# Altium schematic sheet BlockDiagram.SchDoc
size B; SheetNumber: 1; SheetTotal: 7
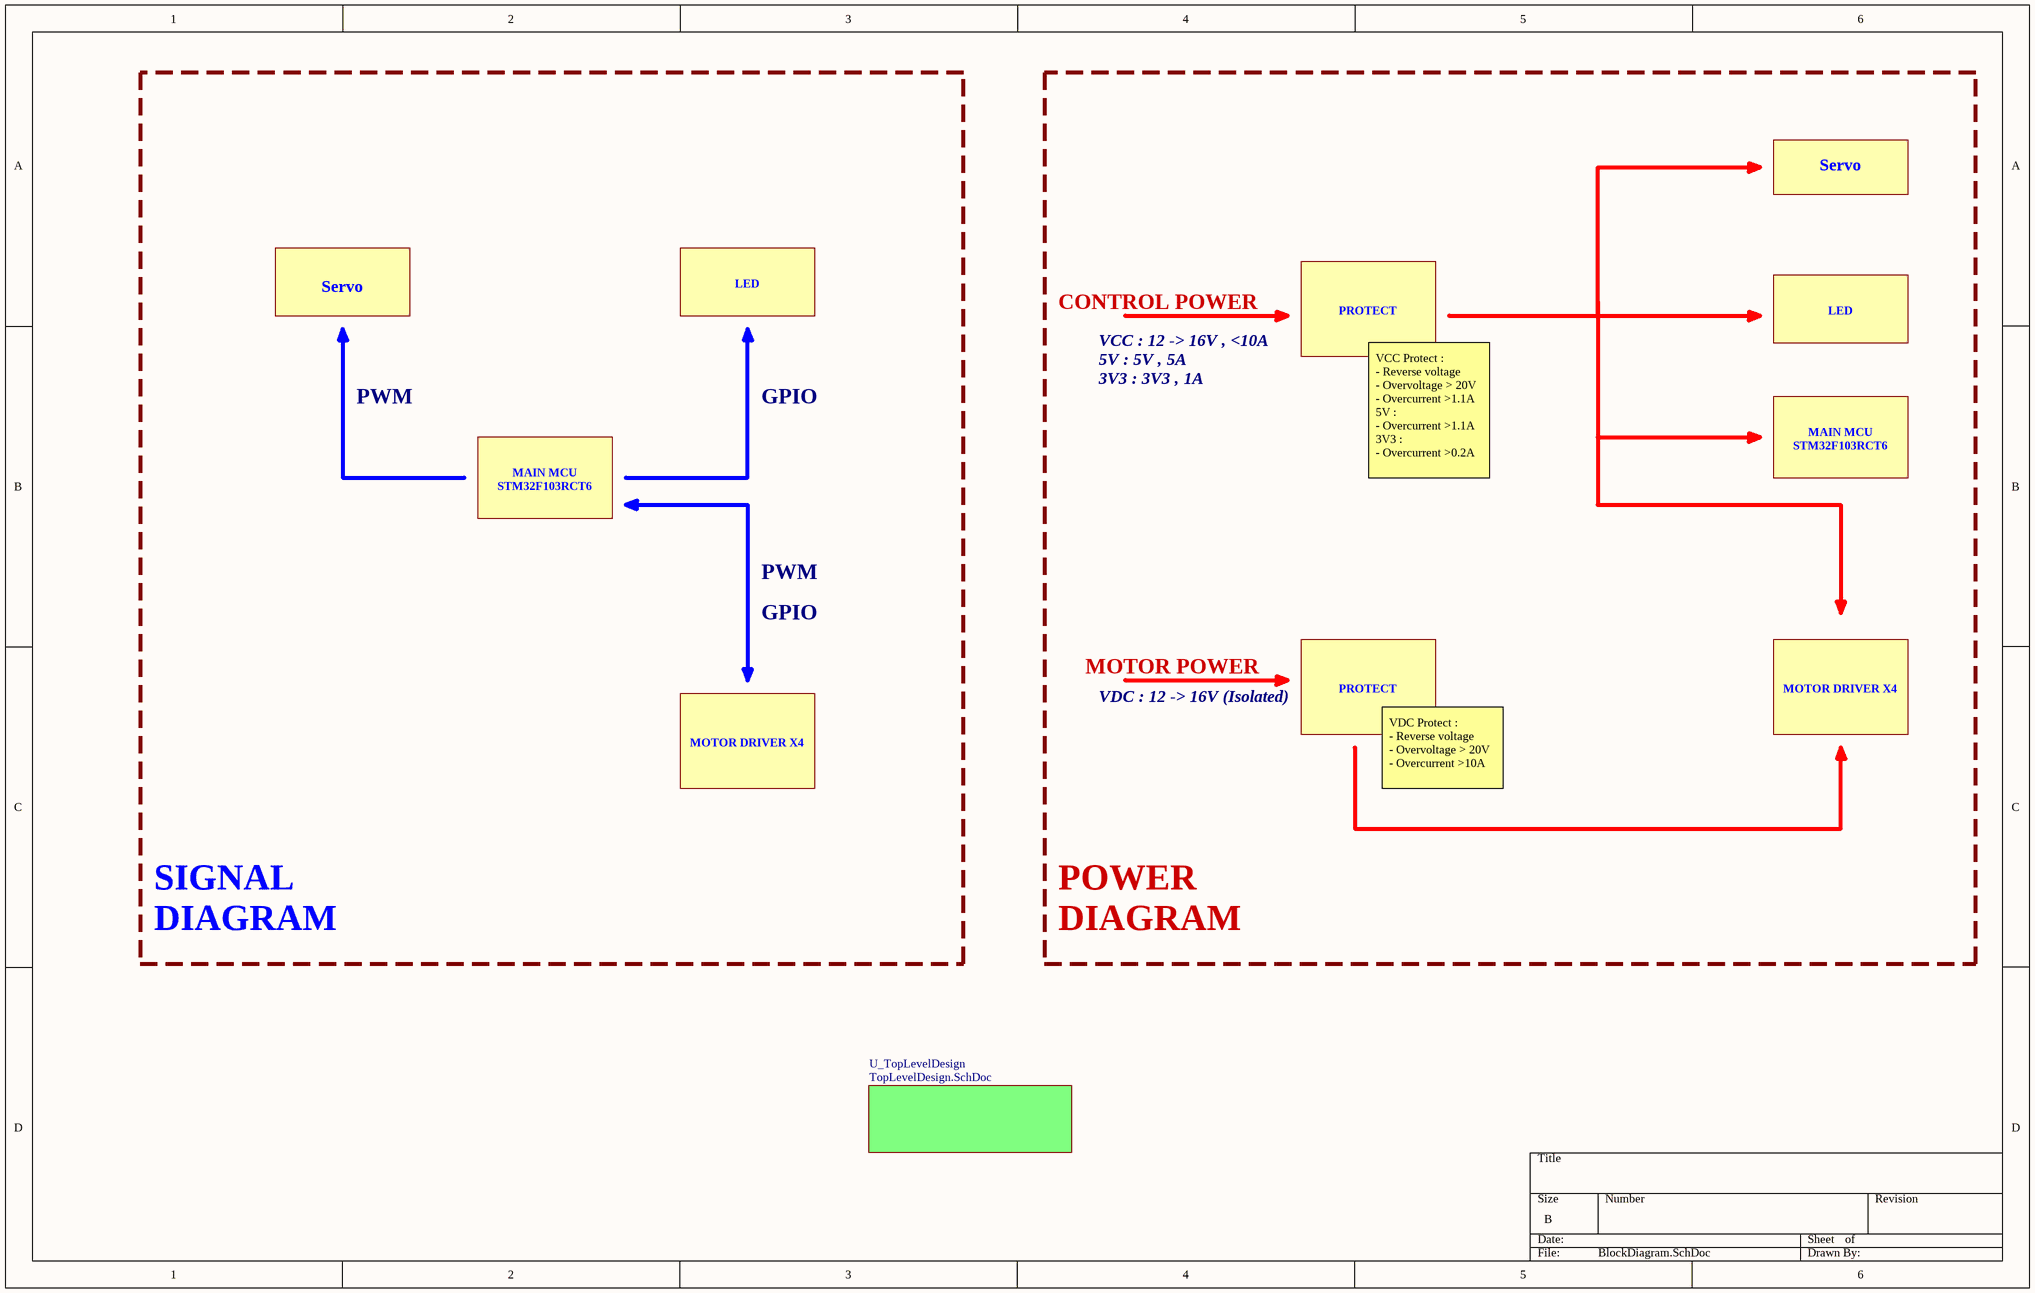
[diagram p0: BlockDiagram.SchDoc]

## Sub-sheets
U_TopLevelDesign = TopLevelDesign.SchDoc: no entries

## Notes on the sheet
- Servo
- LED
- CONTROL POWER
- PROTECT
- PWM
- GPIO
- VCC : 12 -> 16V , <10A
  5V : 5V , 5A
  3V3 : 3V3 , 1A
- MAIN MCU
  STM32F103RCT6
- VCC Protect :
  - Reverse voltage
  - Overvoltage > 20V
  - Overcurrent >1.1A
  5V :
  - Overcurrent >1.1A
  3V3 :
  - Overcurrent >0.2A
- MOTOR POWER
- VDC : 12 -> 16V (Isolated)
- MOTOR DRIVER X4
- VDC Protect :
  - Reverse voltage
  - Overvoltage > 20V
  - Overcurrent >10A
- SIGNAL
  DIAGRAM
- POWER
  DIAGRAM